# Altium schematic sheet 3V3.SchDoc
size A; SheetNumber: 3
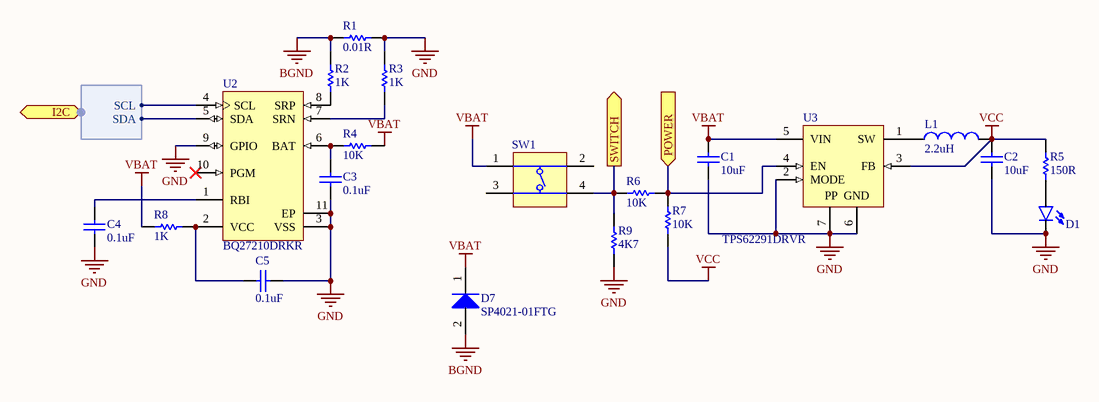
[diagram p0: 3V3.SchDoc]

## Parts
C1  value 10uF  [C0402[1005X55]]  (hidden comment: 10uF 6.3V 0402)
C2  value 10uF  [C0402[1005X55]]  (hidden comment: 10uF 6.3V 0402)
C3  value 0.1uF  [C0402[1005X55]]  (hidden comment: 0.1uF 100V 0402)
C4  value 0.1uF  [C0402[1005X55]]  (hidden comment: 0.1uF 100V 0402)
C5  value 0.1uF  [C0402[1005X55]]  (hidden comment: 0.1uF 100V 0402)
D1  LED_0603_BLUE_5mA  [LED0603]  (value not drawn)
D7  SP4021-01FTG  [SOD-323]
L1  2.2uH  [IND0805]
R1  value 0.01R  [R1206[3216]]  (hidden comment: 0.01R 1% 1206)
R2  value 1K  [R0402[1005]]  (hidden comment: 1K 1% 0402)
R3  value 1K  [R0402[1005]]  (hidden comment: 1K 1% 0402)
R4  value 10K  [R0402[1005]]  (hidden comment: 10K 1% 0402)
R5  value 150R  [R0402[1005]]  (hidden comment: 150R 1% 0402)
R6  value 10K  [R0402[1005]]  (hidden comment: 10K 1% 0402)
R7  value 10K  [R0402[1005]]  (hidden comment: 10K 1% 0402)
R8  value 1K  [R0402[1005]]  (hidden comment: 1K 1% 0402)
R9  value 4K7  [R0402[1005]]  (hidden comment: 4K7 1% 0402)
SW1  (no value)  [SWITCH]
U2  BQ27210DRKR  [DRK0010A]
U3  TPS62291DRVR  [WSON-6]

## Ports
I2C (harness I2C), POWER (in), SWITCH (out)

## Harnesses
I2C: SCL, SDA

## Nets
BGND: D7.2(A) R1.1 R2.2
GND: C1.1 C2.1 C3.1 C4.1 C5.2 D1.C R1.2 R3.2 R9.1 U2.3(VSS) U2.9(GPIO) U2.11(EP) U3.2(MODE) U3.6(GND) U3.7(EP)
VBAT: C1.2 D7.1(K) R4.2 R8.2 SW1.1(T1) U3.5(VIN)
VCC: C2.2 L1.2 R5.1 R7.1 U3.3(FB)
POWER: R6.2 R7.2 U3.4(EN) ; port POWER
SWITCH: R6.1 R9.2 SW1.4(T3) ; port SWITCH
NetC3_2: C3.2 R4.1 U2.6(BAT)
NetC4_2: C4.2 U2.1(RBI)
NetC5_1: C5.1 R8.1 U2.2(VCC)
NetD1_A: D1.A R5.2
NetL1_1: L1.1 U3.1(SW)
NetR2_1: R2.1 U2.8(SRP)
NetR3_1: R3.1 U2.7(SRN)
NetU2_4: U2.4(SCL) ; port I2C.SCL
NetU2_5: U2.5(SDA) ; port I2C.SDA

Not connected (* = marked no-connect by the designer): SW1 2(T2) 3(T3); U2 10(PGM)*

## Notes on the sheet
- (in symbol TPS62291DRVR) PP

## Library data of the parts
C1 C2 = CAP_10uF_6.3V_0402_20%: 10uF 6.3V 20% 0402 (1005 Metric); PartNumber: GRM155R60J106ME44D; Manufacturer: Murata; Tolerance: 20%; Mounting Technology: Surface Mount; PackageReference: 0402; PackageDescription: 0402 (1005 Metric); Voltage: 6.3V
C3-C5 = CAP_0.1uF_100V_0402_10%: 0.1uF 100V 10% 0402 (1005 Metric); PartNumber: GRM155R62A104KE14D; Manufacturer: Murata; Mounting Technology: Surface Mount; PackageReference: 0402; PackageDescription: 0402 (1005 Metric); Voltage: 100V; Tolerance: 10%
D1 = LED_0603_BLUE_5mA: PartNumber: LTST-C193TBKT-5A; Manufacturer: Lite-On Inc.; PackageReference: 0603; PackageDescription: 0603 (1608 Metric); Mounting Technology: Surface Mount
D7 = SP4021-01FTG: Manufacturer: Littelfuse; PartNumber: SP4021-01FTG; PackageReference: SOD-323-2; Mounting Technology: Surface Mount
L1 = IND_2.2uH_1.7A_0805_20%: 2.2uH 20% 1.7A 0805; PartNumber: LQM21PN2R2MGHL; Manufacturer: Murata; PackageReference: 0805; PackageDescription: 0805 (2012 metric); Value: 2.2uH; Mounting Technology: Surface Mount; Current: 1.7A
R1 = RES_0.01R_1206_1%_1.5W: 0.01R 1.5W 1% 1206 (3216 Metric); Manufacturer: KOA Speer; PartNumber: TLR2BPDTD10L0F75; Tolerance: 1%; Power: 1.5W; Mounting Technology: Surface Mount; PackageReference: 1206; PackageDescription: 1206 (3216 Metric)
R2 R3 R8 = RES_1K_0402_1%: 1K 0.063W 1% 0402 (1005 Metric); Manufacturer: KOA Speer; PartNumber: RK73H1ETTP1001F; Tolerance: 1%; Power: 0.063W; Mounting Technology: Surface Mount; PackageReference: 0402; PackageDescription: 0402 (1005 Metric); ComponentLink1Description: Datasheet; ComponentLink1URL: http://www.koaspeer.com/catimages/Products/RK73H/RK73H.pdf
R4 R6 R7 = RES_10K_0402_1%: 10K 0.063W 1% 0402 (1005 Metric); Manufacturer: KOA Speer; PartNumber: RK73H1ETTP1002F; Tolerance: 1%; Power: 0.063W; Mounting Technology: Surface Mount; PackageReference: 0402; PackageDescription: 0402 (1005 Metric); ComponentLink1Description: Datasheet; ComponentLink1URL: http://www.koaspeer.com/catimages/Products/RK73H/RK73H.pdf
R5 = RES_150R_0402_1%: 150R 0.063W 1% 0402 (1005 Metric); Manufacturer: KOA Speer; PartNumber: RK73H1ETTP1500F; Tolerance: 1%; Power: 0.063W; Mounting Technology: Surface Mount; PackageReference: 0402; PackageDescription: 0402 (1005 Metric); ComponentLink1Description: Datasheet; ComponentLink1URL: http://www.koaspeer.com/catimages/Products/RK73H/RK73H.pdf
R9 = RES_4K7_0402_1%: 4K7 0.063W 1% 0402 (1005 Metric); Manufacturer: KOA Speer; PartNumber: RK73H1ETTP4701F; Tolerance: 1%; Power: 0.063W; Mounting Technology: Surface Mount; PackageReference: 0402; PackageDescription: 0402 (1005 Metric); ComponentLink1Description: Datasheet; ComponentLink1URL: http://www.koaspeer.com/catimages/Products/RK73H/RK73H.pdf
SW1 = DIPT-DTSM-6: Switch, SPNO Push Button SMD; Manufacturer: C&K Components; PartNumber: PTS810 SJM 250 SMTR LFS; Packing Type: Tape&Reel; Mechanical Life: 200,000 cycles; ComponentLink2URL: http://www.dip.com.tw/Products_tact.htm; ComponentLink1URL: http://www.dip.com.tw/; ComponentLink3URL: http://www.dip.com.tw/PDF/pro_tact/DTSM_G_-6_2_-V.pdf; PackageDescription: Switch, Surface Mount, 4 Leads, Body 4.6x2.8mm, Height 1.9mm; ComponentLink2Description: Datasheet; ComponentLink3Description: Package Specification; ComponentLink1Description: Manufacturer URL; PackageReference: PTS810; Mounting Technology: Surface Mount
U2 = CMP-0321-00574-2: Li-Ion and Li-Pol Battery Gas Gauge IC for Portable Applications (bqJUNIOR), -20 to 70 degC, 10-pin VSON (DRK), Green (RoHS & no Sb/Br); Manufacturer: Texas Instruments; Li-Ion: Y; Lead Acid: N; SubFamily: Battery Fuel Gauge; PackageDescription: 10-Pin Plastic Small Outline No-Lead, 4 x 3 x 1 mm Body, 0.5 mm Pitch, Exposed Pad; DatasheetVersion: SLUS707B; NiCd: N; Over Voltage Protection: N; PackageVersion: revD, Feb-2011; PackageReference: DRK0010A; PartNumber: BQ27210DRKR; Li-Polymer: Y; Mounting Technology: Surface Mount; Eco-Plan: Green (RoHS & no Sb/Br); ComponentLink1Description: Datasheet; NiMH: N; ComponentLink1URL: http://www.ti.com/general/docs/lit/getliterature.tsp?genericPartNumber=BQ27210&fileType=pdf
U3 = TPS62291DRVR: Voltage Regulators - Switching Regulators 2.25MHz 1A Step-Down Cnvrtr 3.3V Output; Manufacturer: Texas Instruments; PartNumber: TPS62291DRVR; PackageReference: WSON-6; PackageDescription: SON, 6-Leads, Body 2x2mm, Pitch 0.65mm, Thermal Pad 1.6x1mm, TI Recommended; Mounting Technology: Surface Mount